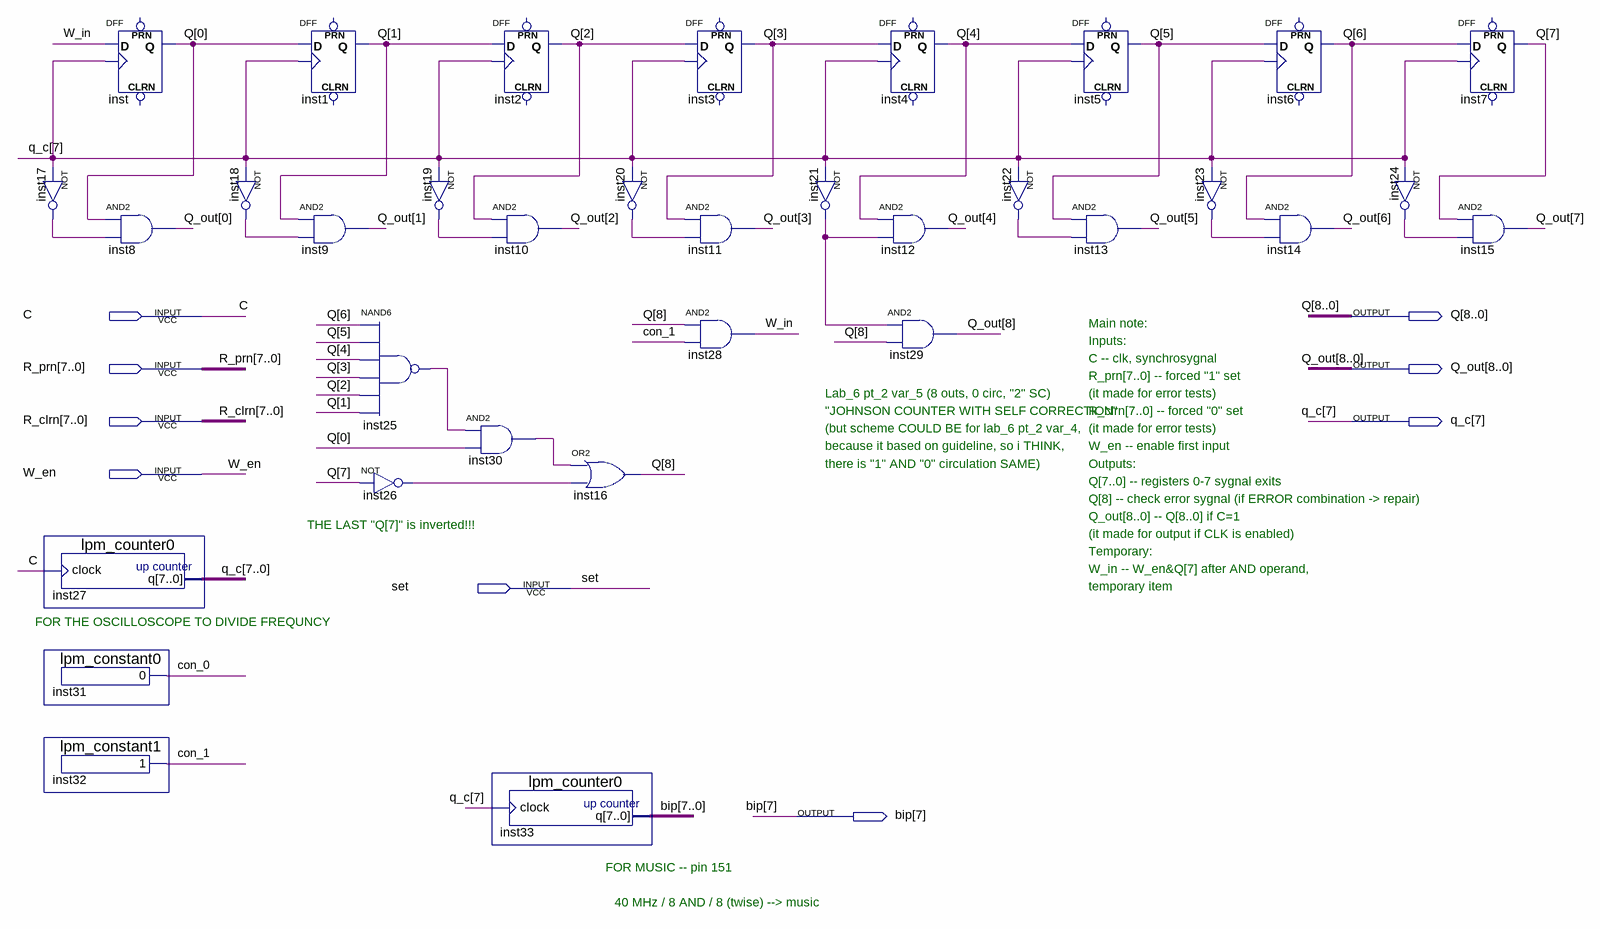
[diagram p0: schematic sheet]
// Quartus schematic Laboratory_work_6_2_circOUR_project.bdf as structural Verilog: 34 symbols, 9 pins
module Laboratory_work_6_2_circOUR_project (
  input  C,
  input  [7:0] R_prn,
  input  [7:0] R_clrn,
  input  W_en,
  input  set,
  output [8:0] Q,
  output [8:0] Q_out,
  output [7:0] q_c,
  output [7:0] bip
);

  wire con_0, con_1, inst17_out, inst18_out, inst19_out, inst20_out, inst21_out, inst22_out, inst23_out,
       inst24_out, inst25_out, inst26_out, inst30_out, W_in;

  not inst17 (inst17_out, q_c[7]);
  lpm_counter0 inst27 (.clock(C), .q(q_c));
  lpm_constant0 inst31 (.result(con_0));
  lpm_constant1 inst32 (.result(con_1));
  DFF inst (.CLK(q_c[7]), .D(W_in), .Q(Q[0]));  // open: CLRN, PRN
  and inst8 (Q_out[0], Q[0], inst17_out);
  not inst18 (inst18_out, q_c[7]);
  DFF inst1 (.CLK(q_c[7]), .D(Q[0]), .Q(Q[1]));  // open: CLRN, PRN
  and inst9 (Q_out[1], Q[1], inst18_out);
  nand inst25 (inst25_out, Q[6], Q[5], Q[4], Q[3], Q[2], Q[1]);
  not inst26 (inst26_out, Q[7]);
  not inst19 (inst19_out, q_c[7]);
  DFF inst2 (.CLK(q_c[7]), .D(Q[1]), .Q(Q[2]));  // open: CLRN, PRN
  and inst10 (Q_out[2], Q[2], inst19_out);
  and inst30 (inst30_out, inst25_out, Q[0]);
  lpm_counter0 inst33 (.clock(q_c[7]), .q(bip));
  or inst16 (Q[8], inst30_out, inst26_out);
  not inst20 (inst20_out, q_c[7]);
  DFF inst3 (.CLK(q_c[7]), .D(Q[2]), .Q(Q[3]));  // open: CLRN, PRN
  and inst11 (Q_out[3], Q[3], inst20_out);
  and inst28 (W_in, Q[8], con_1);
  not inst21 (inst21_out, q_c[7]);
  DFF inst4 (.CLK(q_c[7]), .D(Q[3]), .Q(Q[4]));  // open: CLRN, PRN
  and inst12 (Q_out[4], Q[4], inst21_out);
  and inst29 (Q_out[8], inst21_out, Q[8]);
  not inst22 (inst22_out, q_c[7]);
  DFF inst5 (.CLK(q_c[7]), .D(Q[4]), .Q(Q[5]));  // open: CLRN, PRN
  and inst13 (Q_out[5], Q[5], inst22_out);
  not inst23 (inst23_out, q_c[7]);
  DFF inst6 (.CLK(q_c[7]), .D(Q[5]), .Q(Q[6]));  // open: CLRN, PRN
  and inst14 (Q_out[6], Q[6], inst23_out);
  not inst24 (inst24_out, q_c[7]);
  DFF inst7 (.CLK(q_c[7]), .D(Q[6]), .Q(Q[7]));  // open: CLRN, PRN
  and inst15 (Q_out[7], Q[7], inst24_out);

  // Notes on the sheet:
  //   Main note:
  //   Inputs:
  //   C -- clk, synchrosygnal
  //   R_prn[7..0] -- forced "1" set
  //   Lab_6 pt_2 var_5 (8 outs, 0 circ, "2" SC)
  //   (it made for error tests)
  //   "JOHNSON COUNTER WITH SELF CORRECTION"
  //   R_clrn[7..0] -- forced "0" set
  //   (but scheme COULD BE for lab_6 pt_2 var_4,
  //   (it made for error tests)
  //   because it based on guideline, so i THINK,
  //   W_en -- enable first input
  //   there is "1" AND "0" circulation SAME)
  //   Outputs:
  //   Q[7..0] -- registers 0-7 sygnal exits
  //   Q[8] -- check error sygnal (if ERROR combination -> repair)
  //   Q_out[8..0] -- Q[8..0] if C=1
  //   THE LAST "Q[7]" is inverted!!!
  //   (it made for output if CLK is enabled)
  //   Temporary:
  //   W_in -- W_en&Q[7] after AND operand,
  //   temporary item
  //   FOR THE OSCILLOSCOPE TO DIVIDE FREQUNCY
  //   FOR MUSIC -- pin 151
  //   40 MHz / 8 AND / 8 (twise) --> music
endmodule
